# Altium schematic sheet LCD12864.SchDoc
size A4
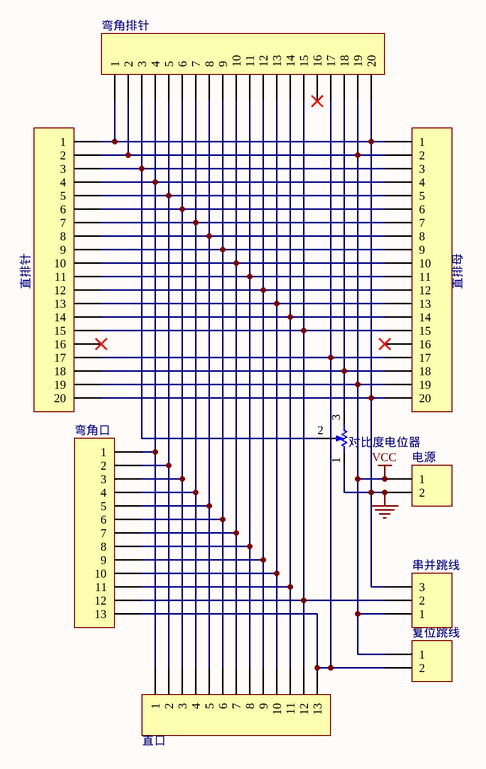
[diagram p0: LCD12864.SchDoc]

## Parts
串并跳线  Header 3  [HDR1X3]  (value not drawn)
复位跳线  Header 2  [HDR1X2]  (value not drawn)
对比度电位器  variable resister  [HDR1X3]  (value not drawn)
弯角口  弯角并口  [HDR1X13]  (value not drawn)
弯角排针  弯角排针  [HDR1X20]  (value not drawn)
电源  电源  [HDR1X2]  (value not drawn)
直口  直口  [HDR1X13]  (value not drawn)
直排母  直角排母  [HDR1X20]  (value not drawn)
直排针  弯角插针  [HDR1X20]  (value not drawn)

## Nets
GND: 串并跳线.3 对比度电位器.1(IN) 弯角排针.1 弯角排针.20 电源.2 直排母.1 直排母.20 直排针.1 直排针.20
VCC: 串并跳线.1 复位跳线.1 弯角排针.2 弯角排针.19 电源.1 直排母.2 直排母.19 直排针.2 直排针.19
Net串并跳线_2: 串并跳线.2 弯角口.12 弯角排针.15 直口.12 直排母.15 直排针.15
Net复位跳线_2: 复位跳线.2 弯角口.13 弯角排针.17 直口.13 直排母.17 直排针.17
Net对比度电位器_2: 对比度电位器.2(OUT) 弯角排针.3 直排母.3 直排针.3
Net对比度电位器_3: 对比度电位器.3(ADJ) 弯角排针.18 直排母.18 直排针.18
Net弯角口_1: 弯角口.1 弯角排针.4 直口.1 直排母.4 直排针.4
Net弯角口_2: 弯角口.2 弯角排针.5 直口.2 直排母.5 直排针.5
Net弯角口_3: 弯角口.3 弯角排针.6 直口.3 直排母.6 直排针.6
Net弯角口_4: 弯角口.4 弯角排针.7 直口.4 直排母.7 直排针.7
Net弯角口_5: 弯角口.5 弯角排针.8 直口.5 直排母.8 直排针.8
Net弯角口_6: 弯角口.6 弯角排针.9 直口.6 直排母.9 直排针.9
Net弯角口_7: 弯角口.7 弯角排针.10 直口.7 直排母.10 直排针.10
Net弯角口_8: 弯角口.8 弯角排针.11 直口.8 直排母.11 直排针.11
Net弯角口_9: 弯角口.9 弯角排针.12 直口.9 直排母.12 直排针.12
Net弯角口_10: 弯角口.10 弯角排针.13 直口.10 直排母.13 直排针.13
Net弯角口_11: 弯角口.11 弯角排针.14 直口.11 直排母.14 直排针.14

Not connected (* = marked no-connect by the designer): 弯角排针 16*; 直排母 16*; 直排针 16*

## Library data of the parts
串并跳线 = Header 3: Header, 3-Pin; LatestRevisionDate: 17-Jul-2002; LatestRevisionNote: Re-released for DXP Platform.; Publisher: Altium Limited
复位跳线 电源 = Header 2: Header, 2-Pin; LatestRevisionDate: 17-Jul-2002; LatestRevisionNote: Re-released for DXP Platform.; Publisher: Altium Limited
对比度电位器 = vr
弯角口 直口 = Header 13: Header, 13-Pin; LatestRevisionDate: 17-Jul-2002; LatestRevisionNote: Re-released for DXP Platform.; Publisher: Altium Limited
弯角排针 直排母 直排针 = Header 20: Header, 20-Pin; LatestRevisionDate: 17-Jul-2002; LatestRevisionNote: Re-released for DXP Platform.; Publisher: Altium Limited